# Altium schematic sheet 2CAN_Processor.SchDoc
size A; SheetNumber: 2; SheetTotal: 3
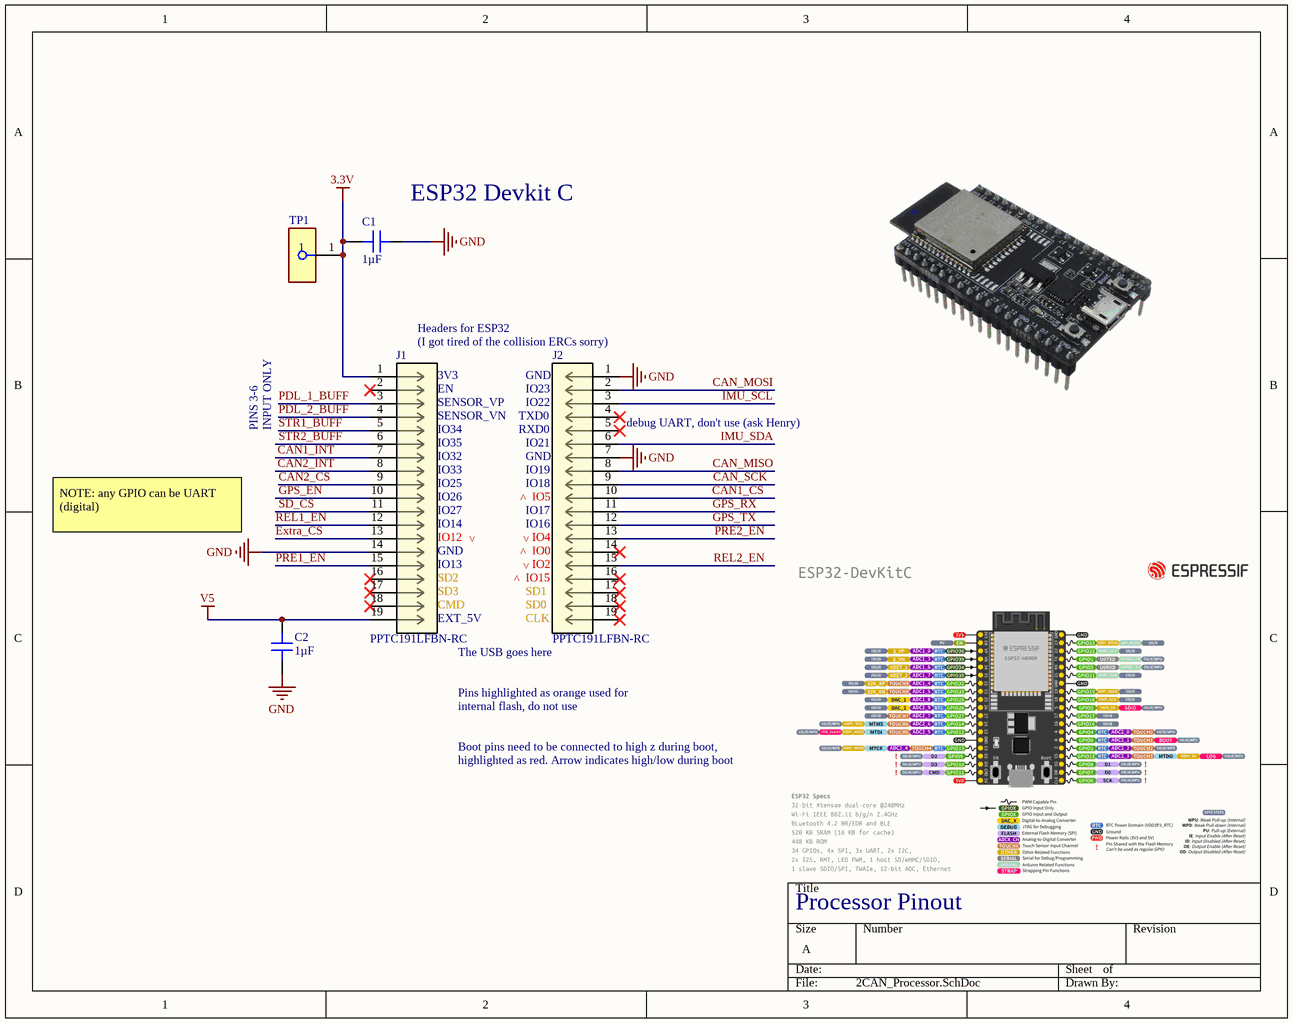
[diagram p0: 2CAN_Processor.SchDoc]

## Parts
C1  1µF  [CAP 0603_1608]
C2  1µF  [CAP 0603_1608]
J1  PPTC191LFBN-RC  [CONN19_PPTC191LFBN-RC_SUL]
J2  PPTC191LFBN-RC  [CONN19_PPTC191LFBN-RC_SUL]
TP1  S2761-46R  [FP-S2761-46R-MFG]  (value not drawn)

## Nets
3.3V: C1.1 J1.1 TP1.1
GND: C1.2 C2.1 J1.14 J2.1 J2.7
V5: C2.2 J1.19
CAN1_CS: J2.10
CAN1_INT: J1.7
CAN2_CS: J1.9
CAN2_INT: J1.8
CAN_MISO: J2.8
CAN_MOSI: J2.2
CAN_SCK: J2.9
Extra_CS: J1.13
GPS_EN: J1.10
GPS_RX: J2.11
GPS_TX: J2.12
IMU_SCL: J2.3
IMU_SDA: J2.6
PDL_1_BUFF: J1.3
PDL_2_BUFF: J1.4
PRE1_EN: J1.15
PRE2_EN: J2.13
REL1_EN: J1.12
REL2_EN: J2.15
SD_CS: J1.11
STR1_BUFF: J1.5
STR2_BUFF: J1.6

Not connected (* = marked no-connect by the designer): J1 2* 16* 17* 18*; J2 4* 5* 14* 16* 17* 18* 19*

## Notes on the sheet
- (near C1) ESP32 Devkit C
- (near J1) Headers for ESP32
- (I got tired of the collision ERCs sorry)
- PINS 3-6
- INPUT ONLY
- (near J1) 3V3
- (near J1) EN
- (near J1) SENSOR_VP
- (near J1) SENSOR_VN
- (near J1) IO34
- (near J2) TXD0
- (near J2) RXD0
- (near J2) GND
- (near J2) IO23
- (near J2) IO22
- (near J2) debug UART, don't use (ask Henry)
- (near J1) IO35
- (near J1) IO32
- (near J1) IO25
- (near J1) IO26
- (near J1) IO33
- (near J2) IO21
- (near J2) IO19
- (near J2) IO18
- (near J2) IO5
- >
- NOTE: any GPIO can be UART (digital)
- (near J1) IO27
- (near J1) IO14
- (near J1) IO12
- (near J1) GND
- (near J1) IO13
- (near J2) IO17
- (near J2) IO16
- (near J2) IO4
- (near J2) IO0
- (near J2) IO2
- (near J1) SD2
- (near J1) SD3
- (near J1) CMD
- (near J1) EXT_5V
- (near J2) IO15
- (near J2) SD1
- (near J2) SD0
- (near J2) CLK
- The USB goes here
- Pins highlighted as orange used for
- internal flash, do not use
- Boot pins need to be connected to high z during boot,
- highlighted as red. Arrow indicates high/low during boot
- Processor Pinout

## Library data of the parts
C1 C2 = 06033D105MAT2A: CAP CER 1UF 25V X5R 0603; manufacturer: AVX Corporation; Tolerance: ±20%; Part Number: 06033D105MAT2A; Value: 1µF; Applications: General Purpose; Capacitance: 1µF; componentlink1description: Datasheet; componentlink1url: http://datasheets.avx.com/cx5r.pdf; componentlink2description: DigiKey Link; componentlink2url: http://digikey.com/product-detail/en/avx-corporation/06033D105MAT2A/478-4531-1-ND/1645882; Device Package: 0603 (1608 Metric); lastupdated: 9/2/2020 1:03:35 AM; Lifecycle Status: Active; Minimum Order: 1; Mounting Type: Surface Mount, MLCC; Operating Temperature: -55°C ~ 85°C; Package / Case: 0603 (1608 Metric); packaging: TapeAndReel; partid: 2656; Part Status: Active; price: 0.11; series: -; Size / Dimension: 0.063" L x 0.032" W (1.60mm x 0.81mm); Supplier 1: DigiKey; Supplier Part Number 1: 478-4531-1-ND; Temperature Coefficient: X5R; Thickness (Max): 0.035" (0.90mm); Voltage - Rated: 25V
J1 J2 = PPTC191LFBN-RC: No Description Available; Mfr_Name: Sullins; Type: DEV; Copyright: Copyright (C) 2023 Ultra Librarian. All rights reserved.; Manufacturer_Part_Number: PPTC191LFBN-RC; RefDes: RefDes
TP1 = CMP-15817-000011-1: PC TEST POINT NATURAL; Body Material: Brass; Plating: Tin; Material: Copper Alloy; Mount: Surface Mount; Color: Natural; Packaging: Tape and Reel; RoHS Compliant: Yes